# Altium schematic sheet PSU3V3-1W-In.SchDoc: Power Supply (20-40V to 3v3 @ 0.1-0.6A)
size A3; DrawnBy: Jonn Dillon; DocumentNumber: 2; Revision: 01; SheetNumber: 2; SheetTotal: 12; Version: 01; Project: AMU 2020 (Sourced from BMS 2020); PageSetup: Record=PageOptions|CenterHorizontal=True|CenterVertical=True|PrintScale=0.97|XCorrection=1.00|YCorrection=1.00|PrintKind=0|BorderSize=5000000|LeftOffset=0|BottomOffset=0|Orientation=2|PaperLength=1000|PaperWidth=1000|Scale=100|PaperSource=7|PrintQuality=-4|MediaType=1|DitherType=10|PaperKind=A4|PrintScaleMode=1
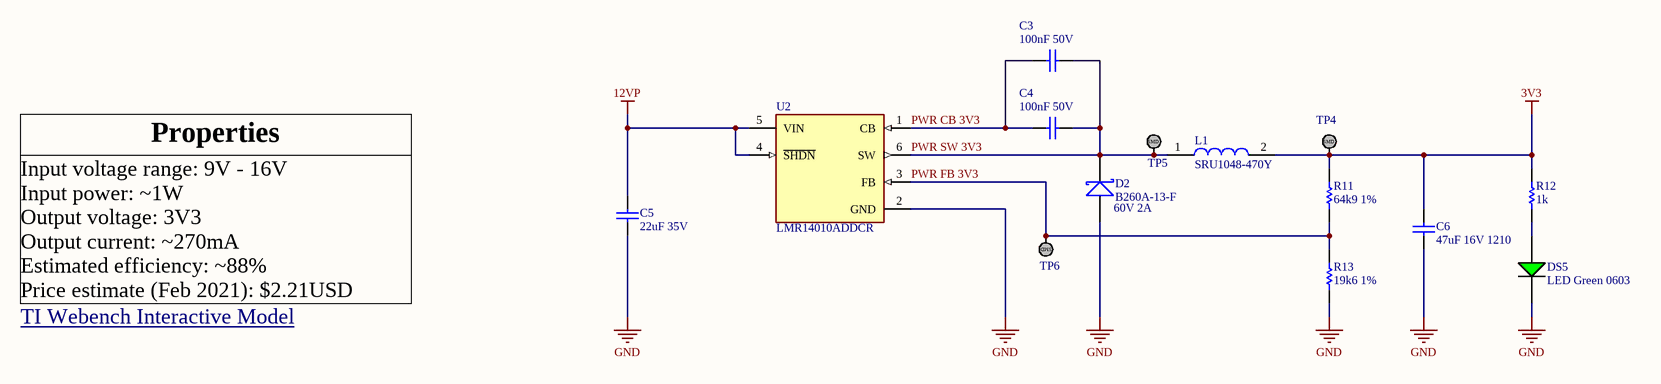
[diagram p0: PSU3V3-1W-In.SchDoc]

## Parts
C3  100nF 50V  [Cap_Ceramic_0603]
C4  100nF 50V  [Cap_Ceramic_0603]
C5  22uF 35V  [Cap_Ceramic_1206]
C6  47uF 16V 1210  [Cap_Ceramic_1210]
D2  B260A-13-F  [SMA]
DS5  LED Green 0603  [LED GREEN 0603]
L1  SRU1048-470Y  [SRU1048]
R11  64k9 1%  [Res_ThinFilm_0603]
R12  1k  [Res_ThinFilm_0603]
R13  19k6 1%  [Res_ThinFilm_0603]
TP4  TestPoint_SMD  [TestPointSMD]  (value not drawn)
TP5  TestPoint_SMD  [TestPointSMD]  (value not drawn)
TP6  TestPoint_SMD  [TestPointSMD]  (value not drawn)
U2  LMR14010ADDCR  [FP-DDC0006A-MFG]

## Nets
3V3: C6.2 L1.2 R11.2 R12.2 TP4.1
12VP: C5.1 U2.4(~{SHDN}) U2.5(VIN)
GND: C5.2 C6.1 D2.A DS5.2(C) R13.1 U2.2(GND)
PWR CB 3V3: C3.1 C4.1 U2.1(CB)
PWR FB 3V3: R11.1 R13.2 TP6.1 U2.3(FB)
PWR SW 3V3: C3.2 C4.2 D2.K L1.1 TP5.1 U2.6(SW)
NetDS5_1: DS5.1(A) R12.1

## Notes on the sheet
- Properties
- (near D2) 60V 2A
- Input voltage range: 9V - 16V
  Input power: ~1W
  Output voltage: 3V3
  Output current: ~270mA
  Estimated efficiency: ~88%
  Price estimate (Feb 2021): $2.21USD
- TI Webench Interactive Model <https://webench.ti.com/power-designer/switching-regulator/customize/18?O1I=0.267&O1V=3.3&VinMax=16.0&VinMin=9.0&action=schematic&base_pn=LMR14010A&lang_chosen=en_US&op_TA=30.0&optFactor=5&origin=ODS__LMR14010A>
- Title
- Size:
- Date:
- A3
- Number:
- Time:
- Revision:
- Sheet
- of
- File:
- (in symbol TestPoint_SMD) SMD

## Library data of the parts
C3 C4 = 100nF 50V 5% X7R 0603: Capacitor, Ceramic, SMD, 100nF, 50V, 5%, X7R, 0603
C5 = 22uF 35V 20% X5R 1206: 22µF ±20% 35V Ceramic Capacitor X5R 1206 (3216 Metric); ComponentLink1Description: Digikey; ComponentLink1URL: https://www.digikey.com.au/product-detail/en/tdk-corporation/C3216X5R1V226M160AC/445-8045-1-ND/2792165; ComponentLink2Description: Datasheet; ComponentLink2URL: https://product.tdk.com/info/en/catalog/datasheets/mlcc_commercial_general_en.pdf
C6 = 47uF 16V 10% X7R 1210: Capacitor, Ceramic, SMD, 47uF, 16V, 5%, X7R, 1210
D2 = B260A-13-F: Diode, Schottky Barrier Rectifier, 60 V, 2 A, B260A-13-F
L1 = SRU1048-470Y: Fixed Inductors 47uH 30% SMD 1048
R11 = 64k9 1% 0603: Resistor, SMD, 64k9, 0.1W, 5%, 0603
R12 = 1k 5% 0603: Resistor, SMD, 1k, 0.1W, 5%, 0603
R13 = 19k6 1% 0603: Resistor, SMD, 19k6, 0.1W, 5%, 0603
U2 = CMP-04918-000056-1: IC REG BUCK ADJ 1A TSOT23-6; Manufacturer: Texas Instruments; Max Junction Temp: +125°C; Number Of Outputs: 1; Standoff Height: 0mm; Switching Frequency: 700kHz; Min Supply Voltage: 4V; Max Supply Voltage: 40V; Max Duty Cycle: 96%; Output Type: AdjustableProgrammable; Manufacturer Part Number: LMR14010ADDCR; Temperature: -40°C to +125°C; Output Current: 1A; Category: IC; Temperature Range High: +125°C; Lead Free: Yes; Switching Topology: Buck; Mouser Description: 4-V to 40-V, 1-A Step-Down Converter With High Efficiency Eco-Mode 6-SOT-23-THIN -40 to 125; Device Class L1: Integrated Circuits (ICs); Digikey Description: IC REG BUCK ADJ 1A TSOT23-6; Package: DDC0006A; Ipc Land Pattern Name: SOT95P280X110-6; Device Class L2: Power Management ICs; Temperature Range Low: -40°C; Height: 1.1mm; Device Class L3: Voltage Regulators - Switching; RoHS: TRUE; Automotive: No; Octopart: https://octopart.com/lmr14010addcr-texas+instruments-90753290; ComponentLink2URL: https://www.ti.com/lit/ds/symlink/lmr14010a.pdf; ComponentLink2Description: Datasheet